# EasyEDA schematic TerraceClimate.json
TITLE: Sheet_1; REV: 1.0; Date: 2026-02-01; Sheet: 1/1; Company: Your Company
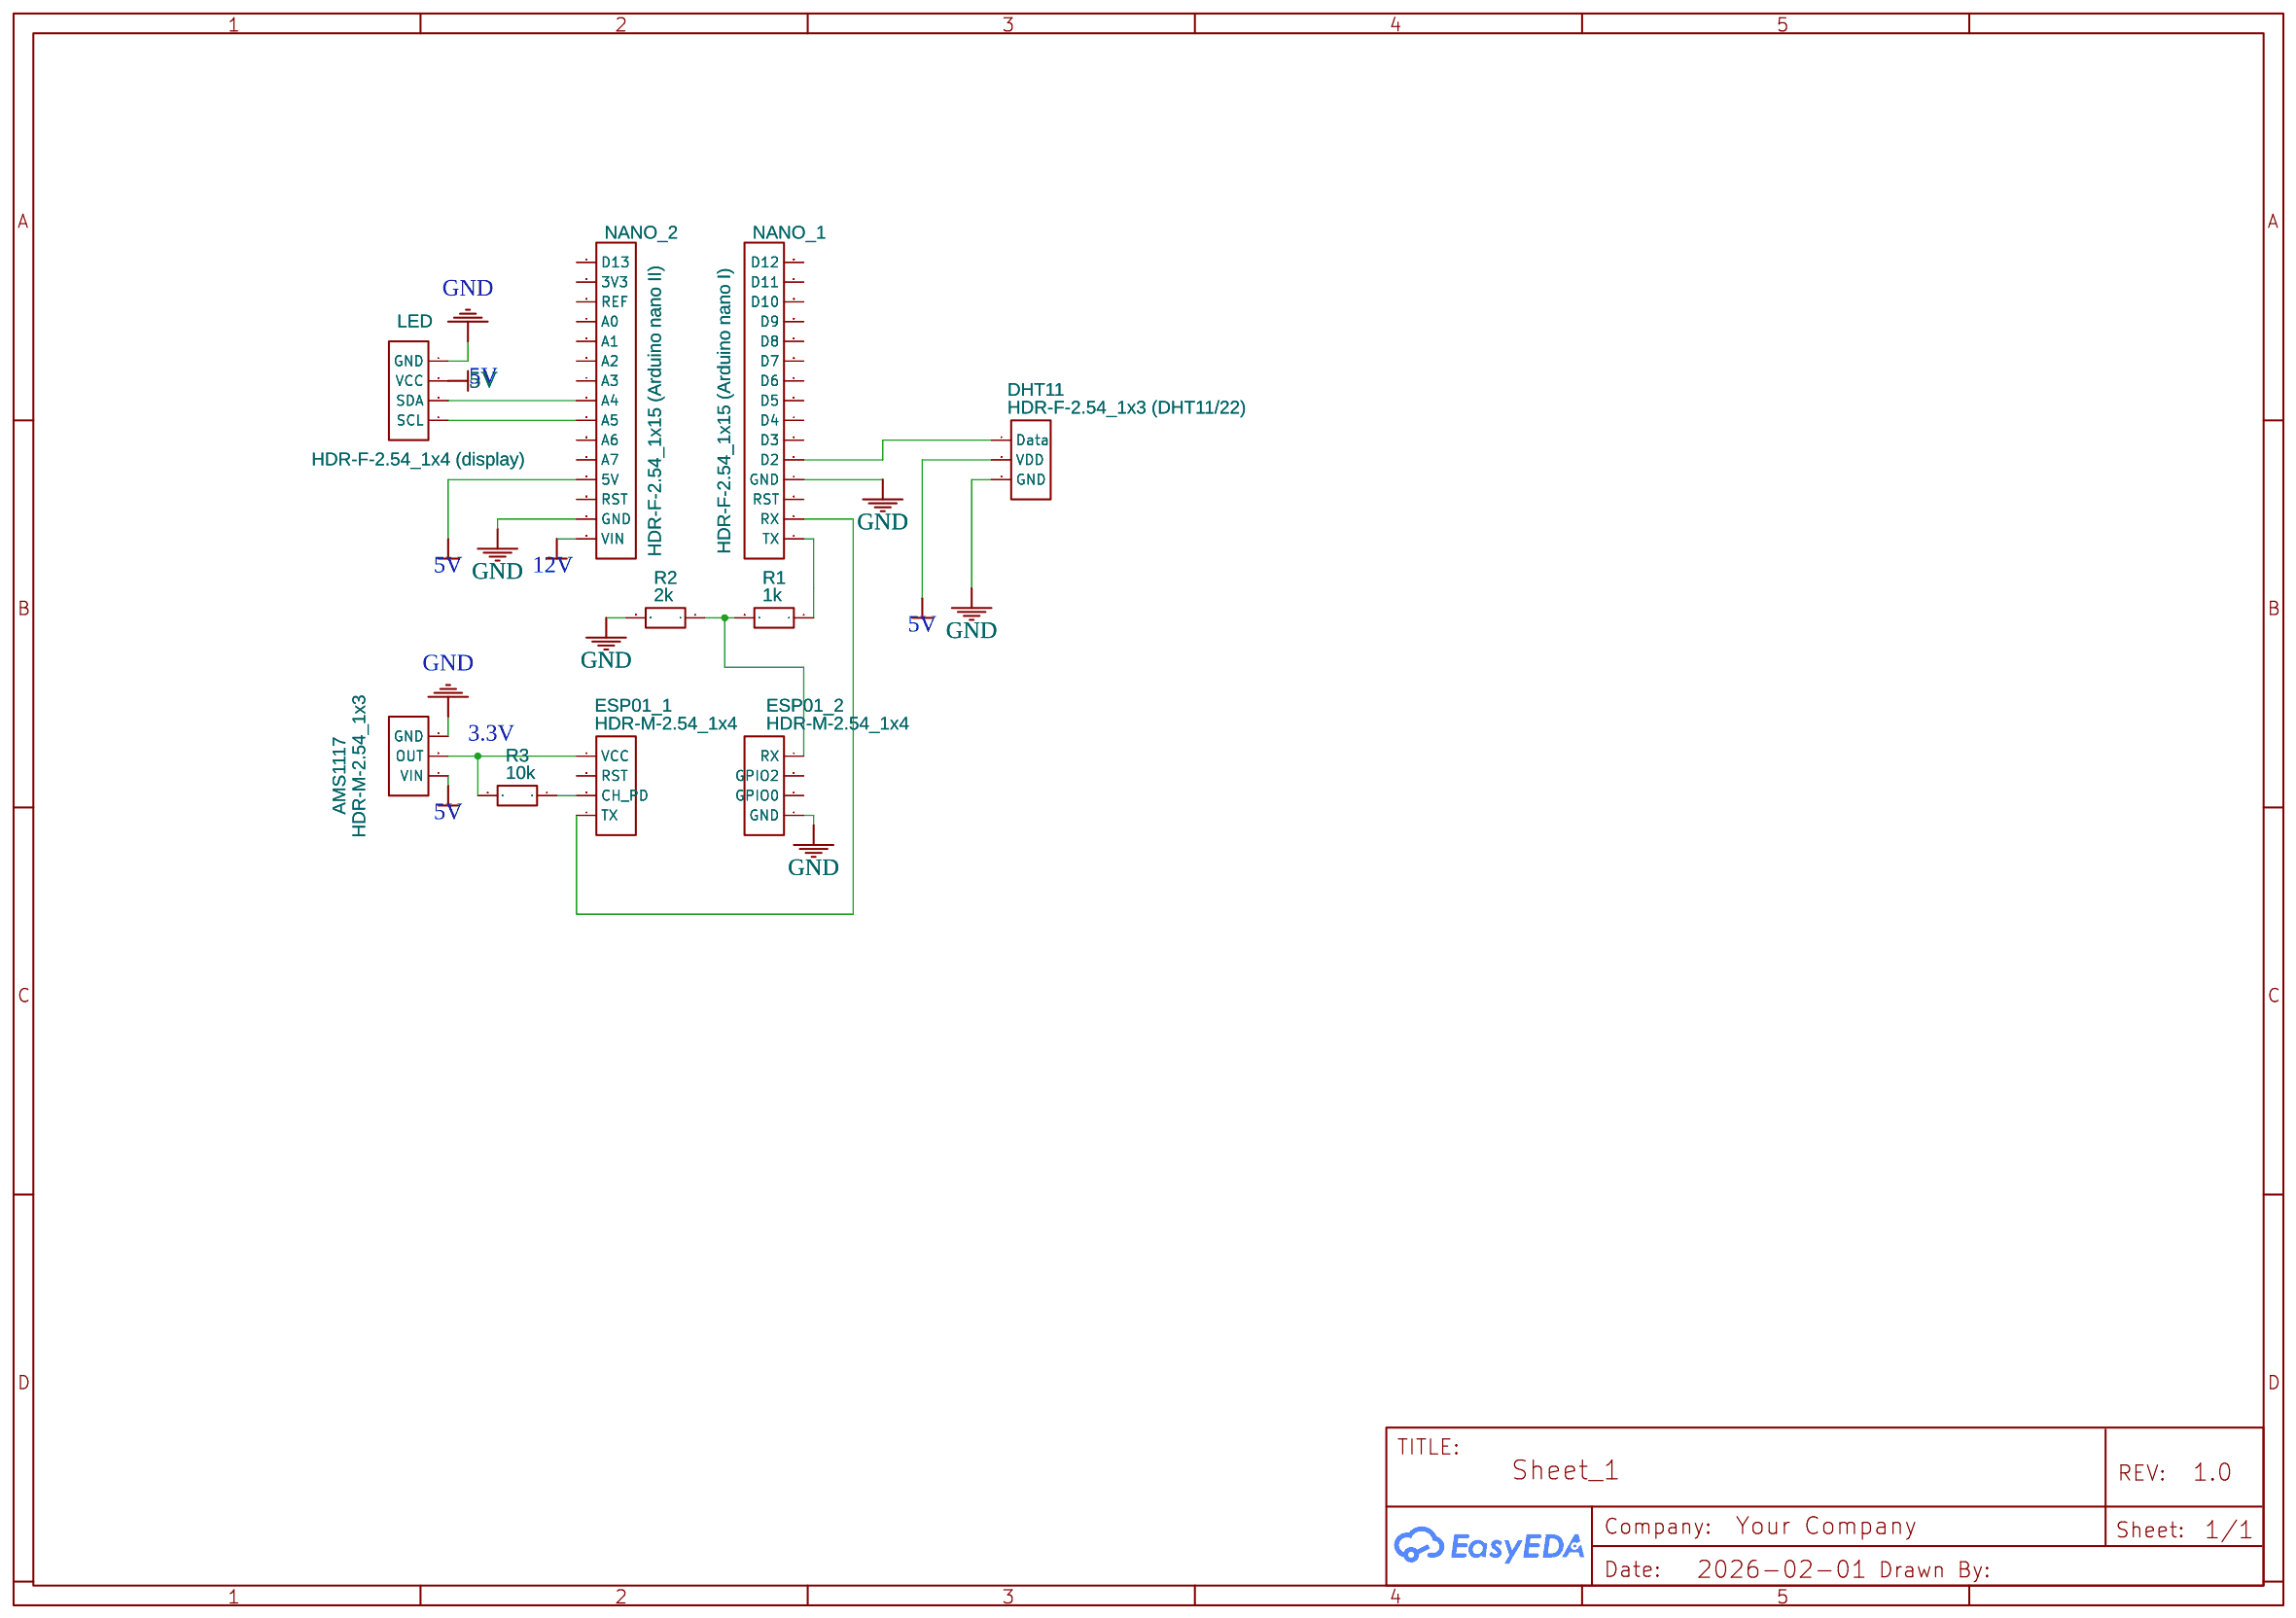
[diagram p0: schematic sheet]

## Parts
AMS1117  HDR-M-2.54_1x3  [HDR-M-2.54_1X3]
DHT11  HDR-F-2.54_1x3 (DHT11/22)  [HDR-F-2.54_1X3]
ESP01_1  HDR-M-2.54_1x4  [HDR-M-2.54_1X4]
ESP01_2  HDR-M-2.54_1x4  [HDR-M-2.54_1X4]
LED  HDR-F-2.54_1x4 (display)  [HDR-F-2.54_1X4]
NANO_1  HDR-F-2.54_1x15 (Arduino nano I)  [HDR-F-2.54_1X15]
NANO_2  HDR-F-2.54_1x15 (Arduino nano II)  [HDR-F-2.54_1X15]
R1  1k  [R0603]
R2  2k  [R0603]
R3  10k  [R0603]

## Library data of the parts
AMS1117 = HDR-M-2.54_1x3: Supplier Part: C180248; Supplier: LCSC; Contributor: LCEDA_Lib
DHT11 = HDR-F-2.54_1x3: Supplier Part: C146690; Supplier: LCSC; Contributor: LCEDA_Lib
ESP01_1 ESP01_2 = HDR-M-2.54_1x4: Supplier Part: C124378; Supplier: LCSC; Contributor: LCEDA_Lib
LED = HDR-F-2.54_1x4: Supplier Part: C225501; Supplier: LCSC; Contributor: LCEDA_Lib
NANO_1 NANO_2 = HDR-F-2.54_1x15: Supplier Part: C124408; Supplier: LCSC; Contributor: LCEDA_Lib
R1-R3 = R_0603_EU: Contributor: LCEDA_Lib

## Nets
5V: AMS1117.1(VIN) DHT11.2(VDD) LED.3(VCC) NANO_2.12(5V)
12V: NANO_2.15(VIN)
GND: AMS1117.3(GND) DHT11.3(GND) ESP01_2.1(GND) LED.4(GND) NANO_1.4(GND) NANO_2.14(GND) R2.2
Net-(AMS1117-2): AMS1117.2(OUT) ESP01_1.1(VCC) R3.2
Net-(DHT11-1): DHT11.1(Data) NANO_1.5(D2)
Net-(ESP01_1-3): ESP01_1.3(CH_PD) R3.1
Net-(ESP01_1-4): ESP01_1.4(TX) NANO_1.2(RX)
Net-(ESP01_2-4): ESP01_2.4(RX) R1.2 R2.1
Net-(LED-1): LED.1(SCL) NANO_2.9(A5)
Net-(LED-2): LED.2(SDA) NANO_2.8(A4)
Net-(NANO_1-1): NANO_1.1(TX) R1.1

Not connected (* = marked no-connect by the designer): ESP01_1 2(RST); ESP01_2 2(GPIO0) 3(GPIO2); NANO_1 3(RST) 6(D3) 7(D4) 8(D5) 9(D6) 10(D7) 11(D8) 12(D9) 13(D10) 14(D11) 15(D12); NANO_2 1(D13) 2(3V3) 3(REF) 4(A0) 5(A1) 6(A2) 7(A3) 10(A6) 11(A7) 13(RST)

## Notes on the sheet
- 5V
- 3.3V
